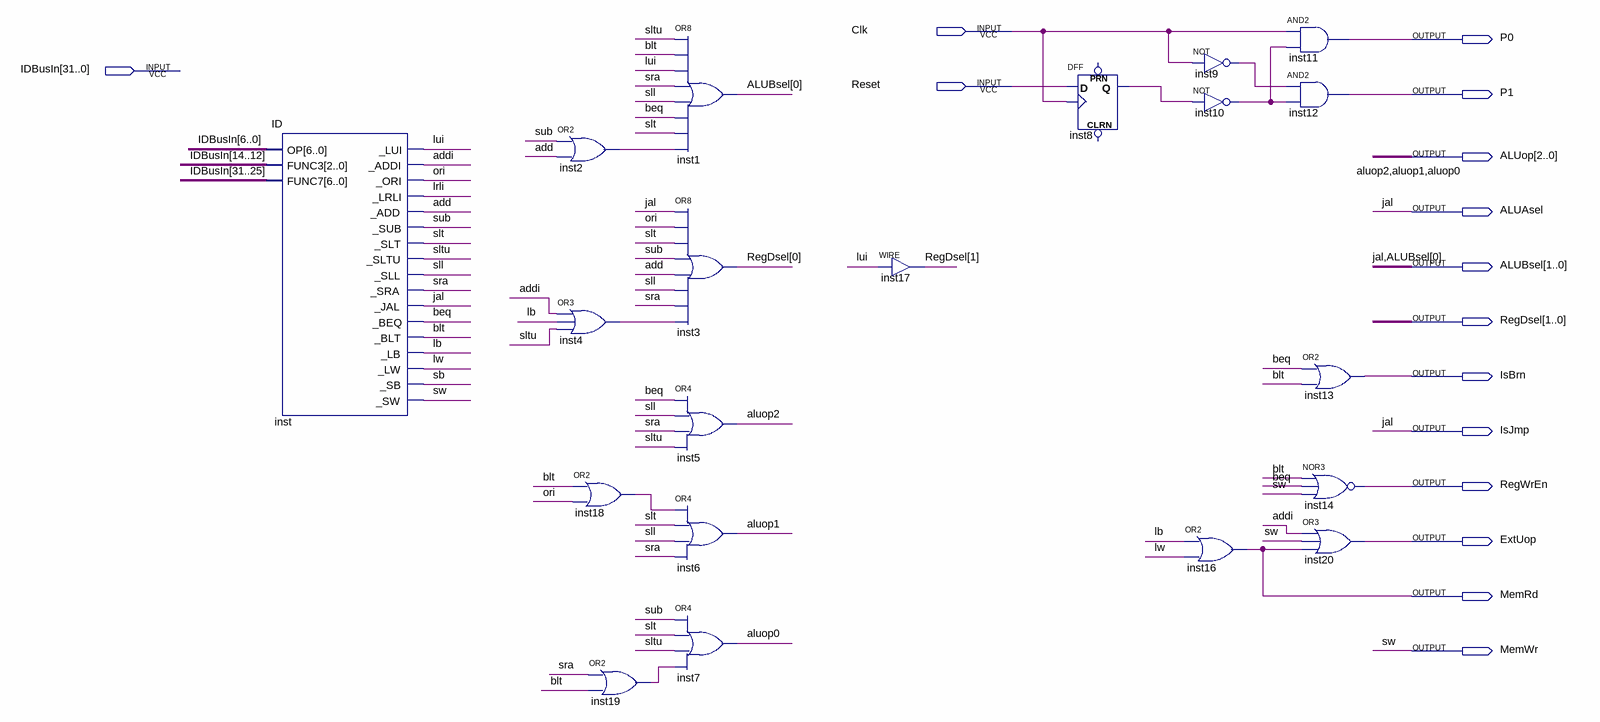
[diagram p0: schematic sheet]
// Quartus schematic CU.bdf as structural Verilog: 20 symbols, 15 pins
module CU (
  input  Clk,
  input  [31:0] IDBusIn,
  input  Reset,
  output P0,
  output P1,
  output [2:0] ALUop,
  output ALUAsel,
  output [1:0] ALUBsel,
  output [1:0] RegDsel,
  output IsBrn,
  output IsJmp,
  output RegWrEn,
  output ExtUop,
  output MemRd,
  output MemWr
);

  wire add, addi, beq, blt, inst2_out, inst4_out, inst8_q, inst9_out, inst10_out, inst18_out, inst19_out, lb,
       lrli, lui, lw, ori, sb, sll, slt, sltu, sra, sub;

  ID inst (
    .OP(IDBusIn[6:0]), .FUNC3(IDBusIn[14:12]), .FUNC7(IDBusIn[31:25]), ._LUI(lui), ._ADDI(addi), ._ORI(ori),
    ._LRLI(lrli), ._ADD(add), ._SUB(sub), ._SLT(slt), ._SLTU(sltu), ._SLL(sll), ._SRA(sra), ._JAL(ALUAsel),
    ._BEQ(beq), ._BLT(blt), ._LB(lb), ._LW(lw), ._SB(sb), ._SW(MemWr));
  or inst2 (inst2_out, sub, add);
  or inst4 (inst4_out, addi, lb, sltu);
  or inst18 (inst18_out, blt, ori);
  or inst19 (inst19_out, sra, blt);
  or inst1 (ALUBsel[0], sltu, blt, lui, sra, sll, beq, slt, inst2_out);
  or inst3 (RegDsel[0], ALUAsel, ori, slt, sub, add, sll, sra, inst4_out);
  or inst5 (ALUop[2], beq, sll, sra, sltu);
  or inst6 (ALUop[1], inst18_out, slt, sll, sra);
  or inst7 (ALUop[0], sub, slt, sltu, inst19_out);
  assign RegDsel[1] = lui;  // WIRE inst17
  DFF inst8 (.CLK(Clk), .D(Reset), .Q(inst8_q));  // open: CLRN, PRN
  not inst9 (inst9_out, Clk);
  not inst10 (inst10_out, inst8_q);
  or inst16 (MemRd, lb, lw);
  and inst11 (P0, Clk, inst10_out);
  and inst12 (P1, inst9_out, inst10_out);
  or inst13 (IsBrn, beq, blt);
  nor inst14 (RegWrEn, blt, beq, MemWr);
  or inst20 (ExtUop, addi, MemWr, MemRd);

  assign ALUBsel[1] = ALUAsel;
  assign IsJmp = ALUAsel;

  // Other names for the same wires on the sheet: jal = ALUAsel; sw = MemWr
endmodule
